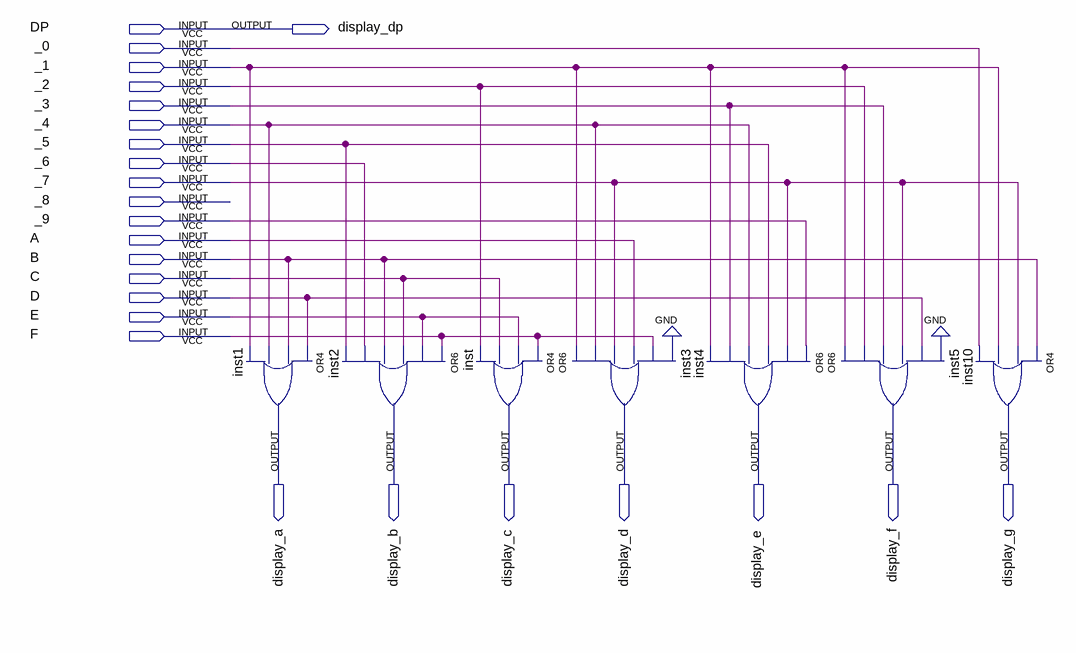
[diagram p0: schematic sheet]
// Quartus schematic display_encoder.bdf as structural Verilog: 7 symbols, 25 pins
module display_encoder (
  input  DP,
  input  _0,
  input  _1,
  input  _2,
  input  _3,
  input  _4,
  input  _5,
  input  _6,
  input  _7,
  input  _8,
  input  _9,
  input  A,
  input  B,
  input  C,
  input  D,
  input  E,
  input  F,
  output display_dp,
  output display_a,
  output display_b,
  output display_c,
  output display_d,
  output display_e,
  output display_f,
  output display_g
);

  or inst1 (display_a, D, B, _4, _1);
  or inst2 (display_b, F, E, C, B, _6, _5);
  or inst (display_c, F, E, C, _2);
  or inst3 (display_d, _1, _4, _7, A, F, 1'b0);
  or inst4 (display_e, _9, _7, _5, _4, _3, _1);
  or inst5 (display_f, _1, _2, _3, _7, D, 1'b0);
  or inst10 (display_g, B, _7, _1, _0);

  assign display_dp = DP;
endmodule
